# Altium schematic sheet Clock.SchDoc
size A4; SheetNumber: 6; SheetTotal: 6
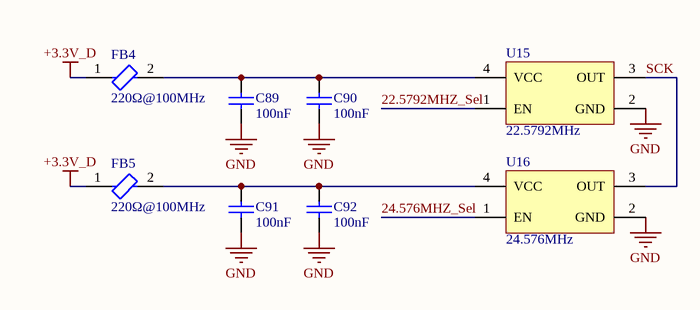
[diagram p0: Clock.SchDoc]

## Parts
C89  100nF  [C 0402_L]
C90  100nF  [C 0402_L]
C91  100nF  [C 0402_L]
C92  100nF  [C 0402_L]
FB4  220Ω@100MHz  [FP-BLM18-0_15-t0_6-d1_2-MFG]
FB5  220Ω@100MHz  [FP-BLM18-0_15-t0_6-d1_2-MFG]
U15  22.5792MHz  [OSC 3225-4P]
U16  24.576MHz  [OSC 3225-4P]

## Nets
+3.3V_D: FB4.1 FB5.1
GND: C89.2 C90.2 C91.2 C92.2 U15.2(GND) U16.2(GND)
22.5792MHZ_Sel: U15.1(EN)
24.576MHZ_Sel: U16.1(EN)
SCK: U15.3(OUT) U16.3(OUT)
NetC89_1: C89.1 C90.1 FB4.2 U15.4(VCC)
NetC91_1: C91.1 C92.1 FB5.2 U16.4(VCC)

## Library data of the parts
C89-C92 = Cap: Capacitor; Value: 10uF; Published: 8-Jun-2000; LatestRevisionDate: 17-Jul-2002; LatestRevisionNote: Re-released for DXP Platform.; PackageReference: RAD-0.3; Publisher: Altium Limited; PackageDescription: Radial Cap, Thru-Hole; 2 Leads; 0.3 in Pin Spacing
FB4 FB5 = CMP-0686-00548-4: Chip Ferrite Bead Array, 0603, 100Ω @ 100MHz, 25%, 0.03Ω, 3A; Number of Lines: 1; DC Resistance (DCR): 30mR; Impedance: 100R; Max DC Current: 3A; Number of Pins: 2; Tolerance: 25%; Height: 0.8mm; Series: BLM18K; Max Operating Temperature: 125°C; Case Code (Metric): 1608; Current Rating: 3A; Weight: 7.1E-05oz; Core Material: Ferrite; Termination: SMD/SMT; Case Code (Imperial): 0603; Width: 0.8mm; Number of Circuits: 1; Package Quantity: 1; Length: 1.6mm; Min Operating Temperature: -55°C; Lead Free: Lead Free; REACH SVHC: No SVHC; Depth: 0.8mm; Max Current Rating: 3A; Test Frequency: 100MHz; Case/Package: 0603; Material: Ferrite; Packaging: Tape and Reel
U15 U16 = XTAL-ACT-4P